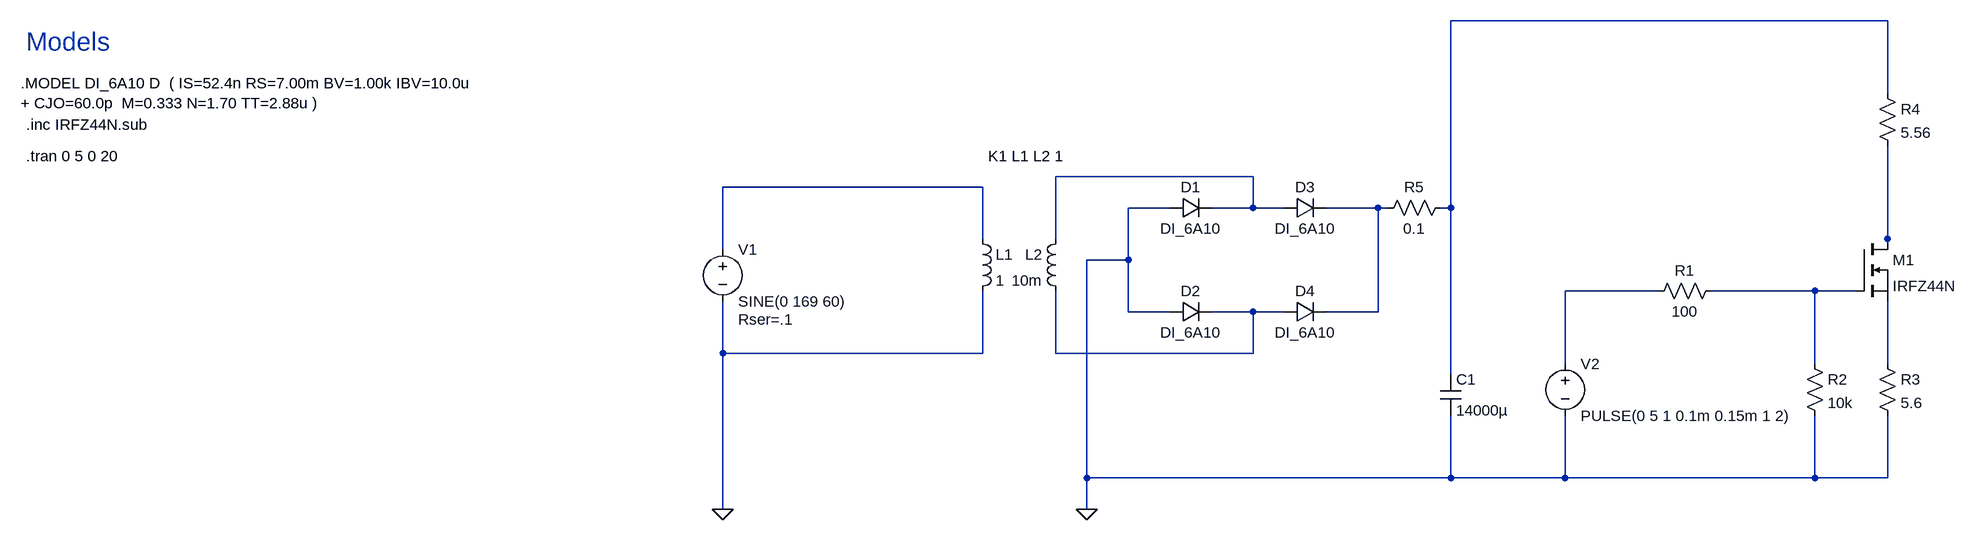
[diagram p0: schematic MOSFET.asc]
MOSFET.asc, the LTspice schematic file:
Version 4.1
SHEET 1 1536 680
WIRE 1424 -368 752 -368
WIRE 1424 -256 1424 -368
WIRE 448 -128 144 -128
WIRE 32 -112 -368 -112
WIRE 320 -80 256 -80
WIRE 448 -80 448 -128
WIRE 448 -80 384 -80
WIRE 496 -80 448 -80
WIRE 640 -80 560 -80
WIRE 656 -80 640 -80
WIRE 752 -80 752 -368
WIRE 752 -80 736 -80
WIRE 32 -32 32 -112
WIRE 144 -32 144 -128
WIRE 1424 -32 1424 -176
WIRE -368 -16 -368 -112
WIRE 1424 -16 1424 -32
WIRE 256 0 256 -80
WIRE 256 0 192 0
WIRE 1072 48 928 48
WIRE 1312 48 1152 48
WIRE 1376 48 1312 48
WIRE 256 80 256 0
WIRE 320 80 256 80
WIRE 448 80 384 80
WIRE 496 80 448 80
WIRE 640 80 640 -80
WIRE 640 80 560 80
WIRE -368 144 -368 64
WIRE 32 144 32 48
WIRE 32 144 -368 144
WIRE 144 144 144 48
WIRE 448 144 448 80
WIRE 448 144 144 144
WIRE 928 160 928 48
WIRE 1312 160 1312 48
WIRE 1424 160 1424 64
WIRE 752 176 752 -80
WIRE 192 336 192 0
WIRE 752 336 752 240
WIRE 752 336 192 336
WIRE 928 336 928 240
WIRE 928 336 752 336
WIRE 1312 336 1312 240
WIRE 1312 336 928 336
WIRE 1424 336 1424 240
WIRE 1424 336 1312 336
WIRE -368 384 -368 144
WIRE 192 384 192 336
FLAG 192 384 0
FLAG -368 384 0
SYMBOL voltage -368 -32 R0
WINDOW 123 0 0 Left 0
WINDOW 39 24 124 Left 2
SYMATTR SpiceLine Rser=.1
SYMATTR InstName V1
SYMATTR Value SINE(0 169 60)
SYMBOL ind 16 -48 R0
SYMATTR InstName L1
SYMATTR Value 1
SYMATTR Type ind
SYMBOL ind 160 -48 M0
SYMATTR InstName L2
SYMATTR Value 10m
SYMATTR Type ind
SYMBOL diode 320 -64 R270
WINDOW 0 32 32 VTop 2
WINDOW 3 0 32 VBottom 2
SYMATTR InstName D1
SYMATTR Value DI_6A10
SYMBOL diode 320 96 R270
WINDOW 0 32 32 VTop 2
WINDOW 3 0 32 VBottom 2
SYMATTR InstName D2
SYMATTR Value DI_6A10
SYMBOL diode 496 -64 R270
WINDOW 0 32 32 VTop 2
WINDOW 3 0 32 VBottom 2
SYMATTR InstName D3
SYMATTR Value DI_6A10
SYMBOL diode 496 96 R270
WINDOW 0 32 32 VTop 2
WINDOW 3 0 32 VBottom 2
SYMATTR InstName D4
SYMATTR Value DI_6A10
SYMBOL voltage 928 144 R0
WINDOW 123 0 0 Left 0
WINDOW 39 0 0 Left 0
SYMATTR InstName V2
SYMATTR Value PULSE(0 5 1 0.1m 0.15m 1 2)
SYMBOL cap 736 176 R0
SYMATTR InstName C1
SYMATTR Value 14000µ
SYMBOL res 1168 32 R90
WINDOW 0 0 56 VBottom 2
WINDOW 3 32 56 VTop 2
SYMATTR InstName R1
SYMATTR Value 100
SYMBOL res 1296 144 R0
SYMATTR InstName R2
SYMATTR Value 10k
SYMBOL nmos 1376 -32 R0
SYMATTR InstName M1
SYMATTR Value IRFZ44N
SYMBOL res 1408 144 R0
SYMATTR InstName R3
SYMATTR Value 5.6
SYMBOL res 1408 -272 R0
SYMATTR InstName R4
SYMATTR Value 5.56
SYMBOL res 752 -96 R90
WINDOW 0 0 56 VBottom 2
WINDOW 3 32 56 VTop 2
SYMATTR InstName R5
SYMATTR Value 0.1
TEXT -1448 -272 Left 2 !.MODEL DI_6A10 D  ( IS=52.4n RS=7.00m BV=1.00k IBV=10.0u\n+ CJO=60.0p  M=0.333 N=1.70 TT=2.88u )
TEXT -1440 -336 Left 4 ;Models
TEXT -1440 -160 Left 2 !.tran 0 5 0 20
TEXT 40 -160 Left 2 !K1 L1 L2 1
TEXT -1440 -208 Left 2 !.inc IRFZ44N.sub

The netlist it stands for:
* MOSFET.asc
V1 N003 0 SINE(0 169 60) Rser=.1
L1 N003 0 1
L2 N002 N008 10m
D1 0 N002 DI_6A10
D2 0 N008 DI_6A10
D3 N002 N004 DI_6A10
D4 N008 N004 DI_6A10
V2 N006 0 PULSE(0 5 1 0.1m 0.15m 1 2)
C1 N001 0 14000µ
R1 N007 N006 100
R2 N007 0 10k
M1 N005 N007 N009 N009 IRFZ44N
R3 N009 0 5.6
R4 N001 N005 5.56
R5 N001 N004 0.1
.model D D
.lib standard.dio
.model NMOS NMOS
.model PMOS PMOS
.lib standard.mos
.MODEL DI_6A10 D  ( IS=52.4n RS=7.00m BV=1.00k IBV=10.0u
+ CJO=60.0p  M=0.333 N=1.70 TT=2.88u )
* Models
.tran 0 5 0 20
K1 L1 L2 1
.inc IRFZ44N.sub
.backanno
.end